# EAGLE design BATT_CONN (EAGLE 9.6.2)
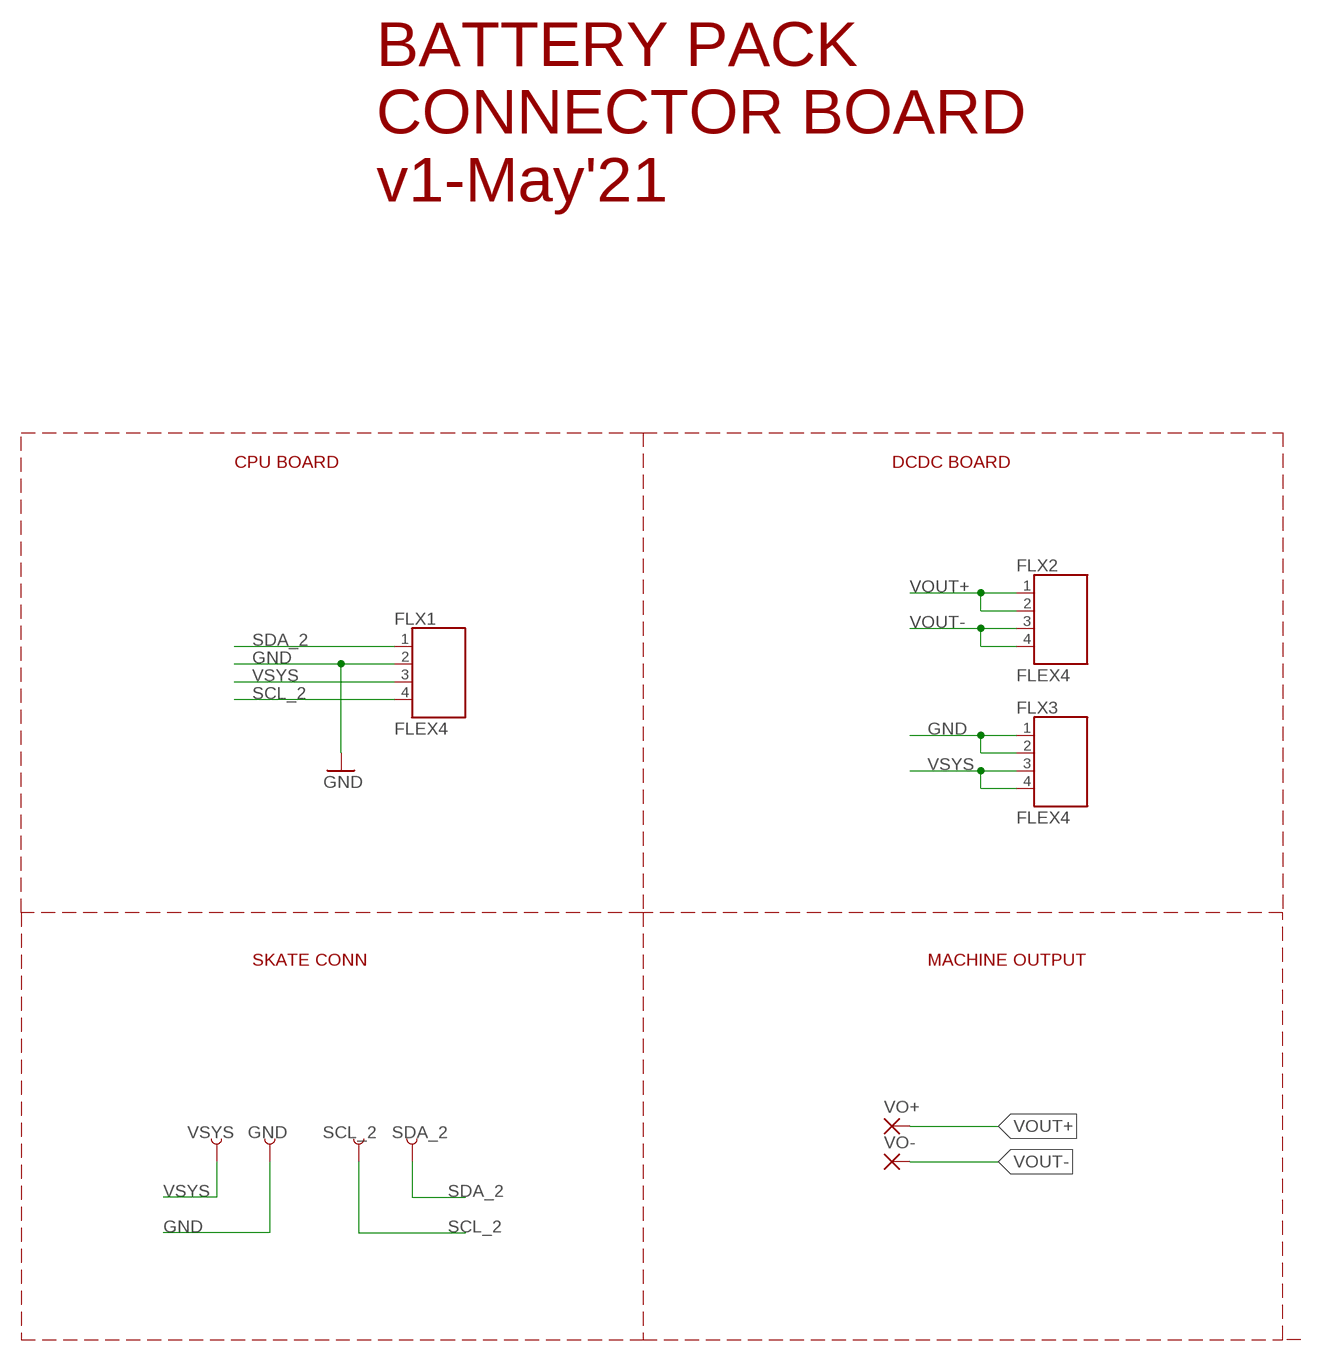
[diagram p0: schematic, sheet 1]

## Parts
FLX1  FLEX4  [FLEX4]
FLX2  FLEX4  [FLEX4]
FLX3  FLEX4  [FLEX4]
GND  TEST-POINT3  [PAD.03X.03]
SCL_2  TEST-POINT3  [PAD.03X.03]
SDA_2  TEST-POINT3  [PAD.03X.03]
VO+  SMD5  [SMD2,54-5,08]
VO-  SMD5  [SMD2,54-5,08]
VSYS  TEST-POINT3  [PAD.03X.03]

## Nets
GND: FLX1.2 FLX3.1 FLX3.2 GND.P$1
SCL_2: FLX1.4 SCL_2.P$1
SDA_2: FLX1.1 SDA_2.P$1
VOUT+: FLX2.1 FLX2.2 VO+.1(P)
VOUT-: FLX2.3 FLX2.4 VO-.1(P)
VSYS: FLX1.3 FLX3.3 FLX3.4 VSYS.P$1

## Notes on the sheet
- BATTERY PACK
  CONNECTOR BOARD
  v1-May'21
- CPU BOARD | DCDC BOARD
- SKATE CONN | MACHINE OUTPUT

## Library data of the parts
FLX1-FLX3 = Flex4:FLEX4
GND SCL_2 SDA_2 VSYS = SparkFun-Connectors:TEST-POINT: SparkFun Test Points Bare copper test points for troubleshooting or In-Circuit-Testing. These are used by our Production team for verifying production board runs using pogo-pins on test beds. SparkFun Products: SparkFun LSM9DS1 Breakout <https://www.sparkfun.com/products/13284> SparkFun PSOC <https://www.sparkfun.com/products/13714> SparkFun Load Cell Amplifier <https://www.sparkfun.com/products/13879>
VO+ VO- = wirepad:SMD5: SMD PAD

## Net classes
1 power: width 0.178 mm
2 gnd: width 0.305 mm, drill 0.483 mm, clearance 0.203 mm

## Board
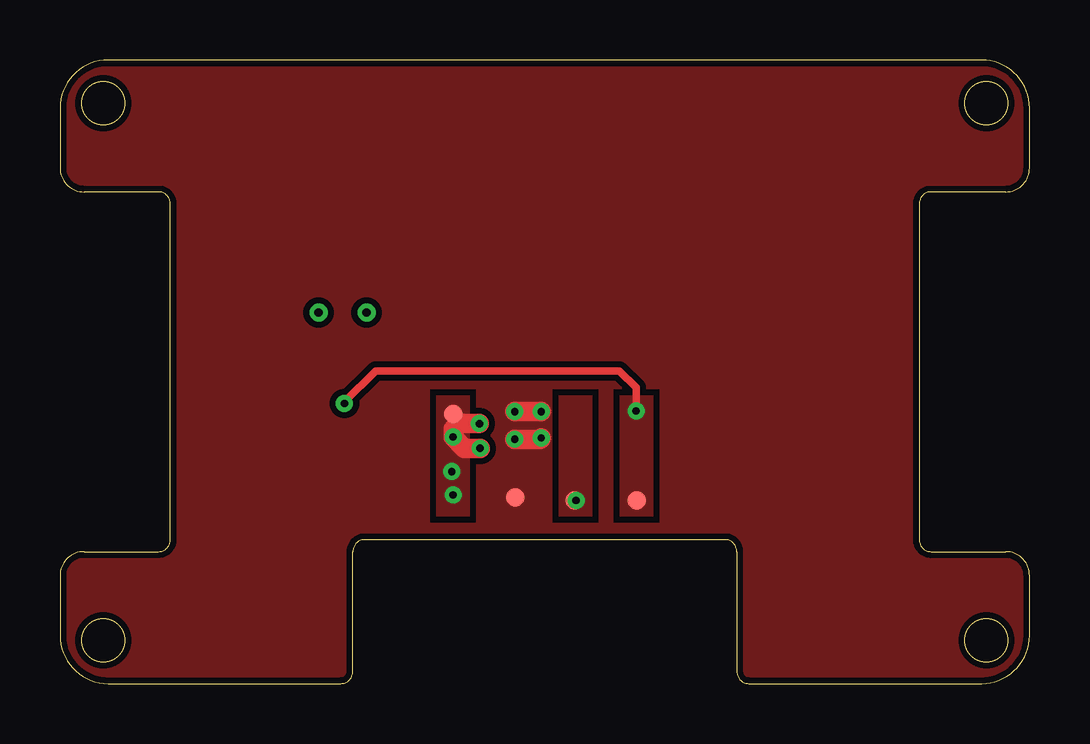
[diagram p1: board, top side]
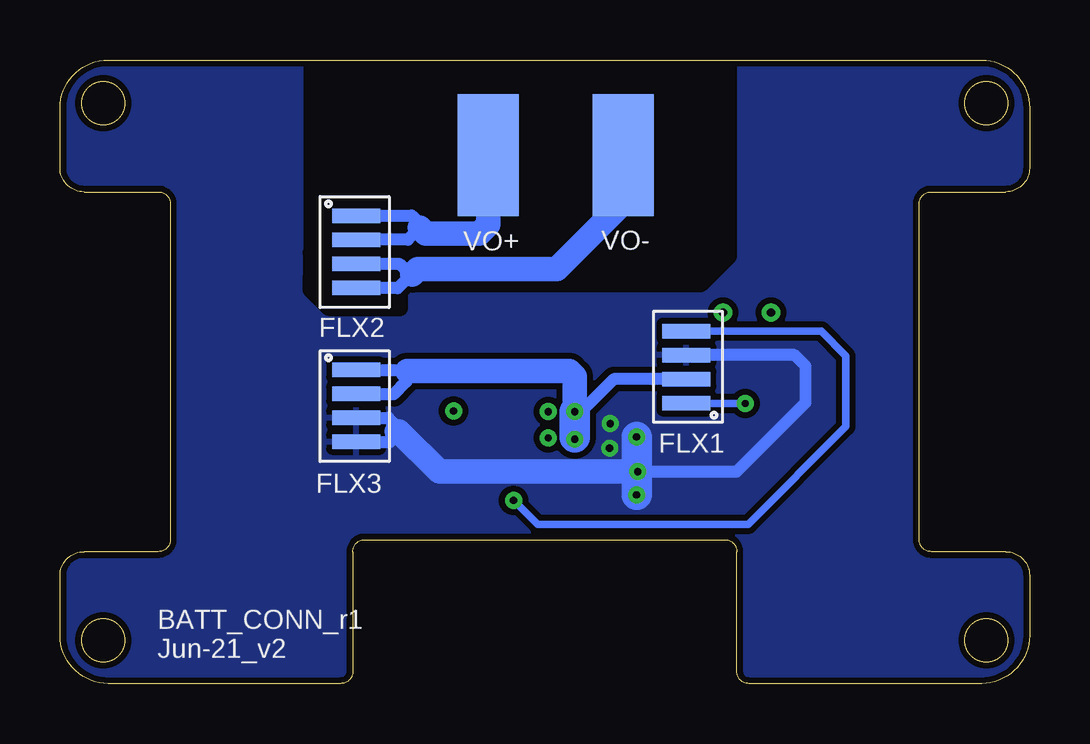
[diagram p2: board, bottom side, seen from below]

Size 40.4 x 26 mm. Coordinates in mm from the lower left corner, seen from the top.
Outline: 0,24 0,21.5 arc90 1,20.5 4.1,20.5 arc-90 4.6,20 4.6,6 arc-90 4.1,5.5 1,5.5 arc90 0,4.5 0,2 arc90 2,0 11.7,0 arc90 12.2,0.5 12.2,5.5 arc-90 12.7,6 27.7,6 arc-90 28.2,5.5 28.2,0.5 arc90 28.7,0 38.4,0 arc90 40.4,2 40.4,4.5 arc90 39.4,5.5 36.3,5.5 arc-90 35.8,6 35.8,20 arc-90 36.3,20.5 39.4,20.5 arc90 40.4,21.5 40.4,24 arc90 38.4,26 2,26 arc90 0,24
Outline: circle at 38.6,1.8 radius 0.9
Outline: circle at 1.8,1.8 radius 0.9
Outline: circle at 1.8,24.2 radius 0.9
Outline: circle at 38.6,24.2 radius 0.9
Copper layers (1*16): Top 0.035mm / dielectric 1.5mm / Bottom 0.035mm
Design rules "default *": minimum track width 6mil, minimum drill 0.3mm, track to track 6mil, track to pad 6mil, pad to pad 6mil, via to via 6mil, smd to smd 6mil, copper to edge 10mil, drill to drill 6mil, minimum pad ring 10mil, minimum via ring 8mil, stop-mask expansion 4mil, vias tented up to drill 50mil, thermal gap 10mil
bRestrict: area 12.5,16.6 to 29.9,26.2; area 26.2,15.6 to 30,18

### Footprints (pad centres in the part's own frame; a part is rotated, then mirrored left to right if it is on the bottom)
FLEX4 = smd 0.6 x 2: 1 -3.77,1.52; 2 -2.77,1.52; 3 -1.77,1.52; 4 -0.77,1.52
PAD.03X.03 = smd 0.762 x 0.762: P$1 0,0
SMD2,54-5,08 = smd 2.54 x 5.08: 1 0,0

### Placement (x,y rotation side)
FLX1  12.78,15.46 90 bottom
FLX2  29.58,15.74 270 bottom
FLX3  29.58,9.31 270 bottom
GND  18.98,7.76 0 top
SCL_2  21.45,7.64 0 top
SDA_2  24.03,7.64 0 top
VO+  22.55,22.04 0 bottom
VO-  16.93,22.04 0 bottom
VSYS  16.38,11.24 0 top

### Tracks (layer width: path | path; a pad name or v marks a point on that pad's centre or on a via)
GND  (via drill 0.3)
  Top 0.813: v20.05,11.34 v18.95,11.34 | v20.05,10.24 20,10.19 v18.95,10.19
  Bottom 0.508: FLX3.1 25.97,13.08 | 25.97,13.08 25.93,13.04 | FLX3.2 26.52,12.08 26.5,12.06 25.97,12.59 25.97,13.08 | FLX1.2 17.32,12.69 18.68,11.34 v18.95,11.34
  Bottom 1.016: v18.95,11.34 18.95,12.81 19.18,13.04 25.93,13.04
  Bottom 1.27: v18.95,11.34 18.95,10.26
  pour Top (isolate 0.254, no thermals): 19.63,6.99 19.63,11.99 18.23,11.99 18.23,6.99
  pour Top (isolate 0.254, rank 2): -0.3,25.99 -0.3,-0.19 40.63,-0.19 40.63,25.99
N$1  (via drill 0.35)
  other vias: 10.78,15.47
N$2  (via drill 0.35)
  other vias: 12.78,15.47
SCL_2  (via drill 0.3)
  Bottom 0.305: FLX1.4 8.68,14.69 7.65,13.66 7.65,10.71 11.73,6.64 20.5,6.64 v21.5,7.64
  pour Top (isolate 0.254, no thermals): 20.78,11.99 20.78,6.99 22.18,6.99 22.18,11.99
SDA_2  (via drill 0.3)
  Top 0.305: v24,11.36 24,12.34 23.3,13.04 13.15,13.04 11.85,11.74 v11.85,11.68
  Bottom 0.305: FLX1.1 v11.85,11.68
  pour Top (isolate 0.254, no thermals): 23.33,11.99 23.33,6.99 24.73,6.99 24.73,11.99
VOUT+
  Bottom 0.508: FLX2.1 25.76,19.51 25.75,19.51 25.4,19.16 25.4,19.01 25.91,18.51 FLX2.2
  Bottom 1.016: VO+.1 22.55,19.14 22.93,18.76 25.15,18.76 25.4,19.01
VOUT-
  Bottom 0.508: FLX2.3 26.27,17.51 25.9,17.14 25.9,16.91 | 25.73,17.06 25.73,17.09 25.9,16.91 | 25.9,16.91 26.33,16.49 28.04,16.49 FLX2.4
  Bottom 1.016: 25.73,17.06 25.5,17.29 19.7,17.29 16.93,20.06 VO-.1
VSYS  (via drill 0.3)
  Top 0.813: v17.48,10.84 16.6,10.84 16.38,10.61 v16.38,10.29 16.85,9.81 v17.5,9.81
  Bottom 0.508: FLX3.3 26.72,11.08 26.38,10.74 26.38,10.51 26.38,10.34 26.65,10.06 28.04,10.06 FLX3.4 | 14.58,13.69 FLX1.3 9.78,13.69 9.33,13.24 9.33,11.71 12.2,8.84 16.3,8.84 v16.33,8.84
  Bottom 1.016: v16.33,8.84 24.6,8.84 26.28,10.51 26.38,10.51
  Bottom 1.27: v16.38,7.86 v16.38,10.29 16.38,8.91 16.3,8.84
  pour Top (isolate 0.254, no thermals): 15.68,11.99 15.68,6.99 17.08,6.99 17.08,11.99
  pour Bottom (isolate 0.254, rank 2): -0.55,26.19 -0.55,-0.49 41.65,-0.49 41.65,26.19

### Text on the board
bPlace: BATT_CONN_r1 / Jun-21_v2